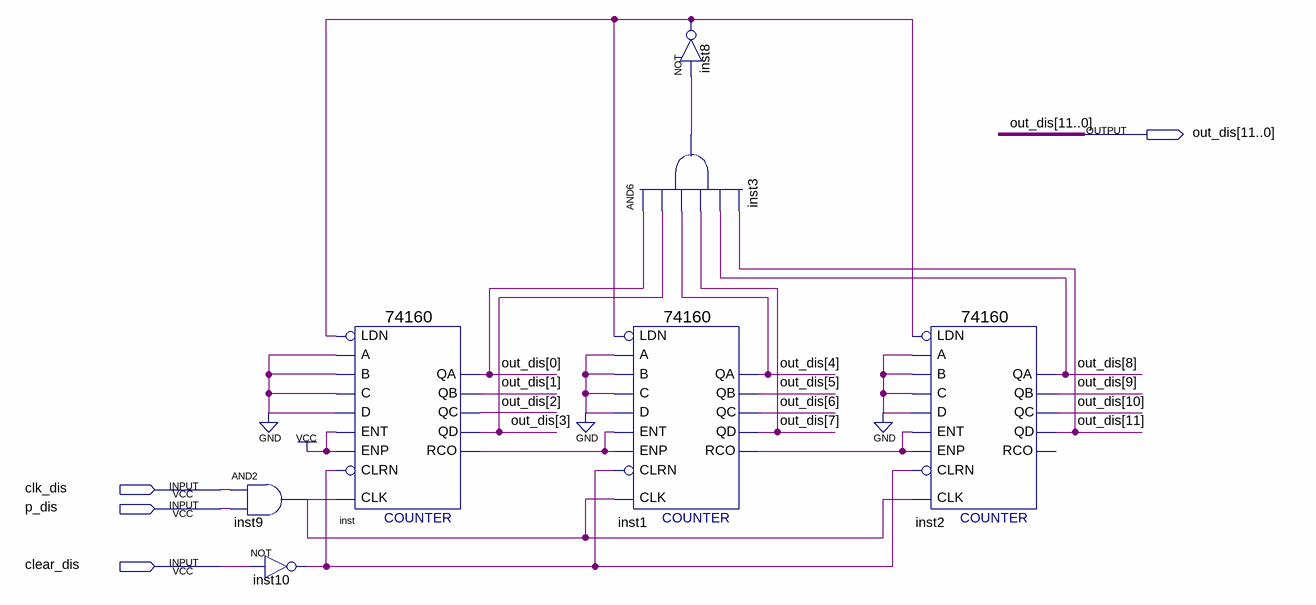
[diagram p0: schematic sheet]
// Quartus schematic count_dis.bdf as structural Verilog: 7 symbols, 4 pins
module count_dis (
  input  clk_dis,
  input  p_dis,
  input  clear_dis,
  output [11:0] out_dis
);

  wire inst1_rco, inst3_out, inst8_out, inst9_out, inst10_out, inst_rco;

  and inst9 (inst9_out, clk_dis, p_dis);
  not inst10 (inst10_out, clear_dis);
  \74160  inst (
    .CLK(inst9_out), .ENT(1'b1), .A(1'b0), .B(1'b0), .C(1'b0), .D(1'b0), .LDN(inst8_out), .ENP(1'b1),
    .CLRN(inst10_out), .QD(out_dis[3]), .QA(out_dis[0]), .QB(out_dis[1]), .QC(out_dis[2]), .RCO(inst_rco));
  not inst8 (inst8_out, inst3_out);
  and inst3 (inst3_out, out_dis[0], out_dis[3], out_dis[4], out_dis[7], out_dis[8], out_dis[11]);
  \74160  inst1 (
    .CLK(inst9_out), .ENT(inst_rco), .A(1'b0), .B(1'b0), .C(1'b0), .D(1'b0), .LDN(inst8_out), .ENP(inst_rco),
    .CLRN(inst10_out), .QD(out_dis[7]), .QA(out_dis[4]), .QB(out_dis[5]), .QC(out_dis[6]), .RCO(inst1_rco));
  \74160  inst2 (
    .CLK(inst9_out), .ENT(inst1_rco), .A(1'b0), .B(1'b0), .C(1'b0), .D(1'b0), .LDN(inst8_out),
    .ENP(inst1_rco), .CLRN(inst10_out), .QD(out_dis[11]), .QA(out_dis[8]), .QB(out_dis[9]), .QC(out_dis[10]));  // open: RCO
endmodule
